# Altium project 2022飞镖系统主控板.PrjPcb
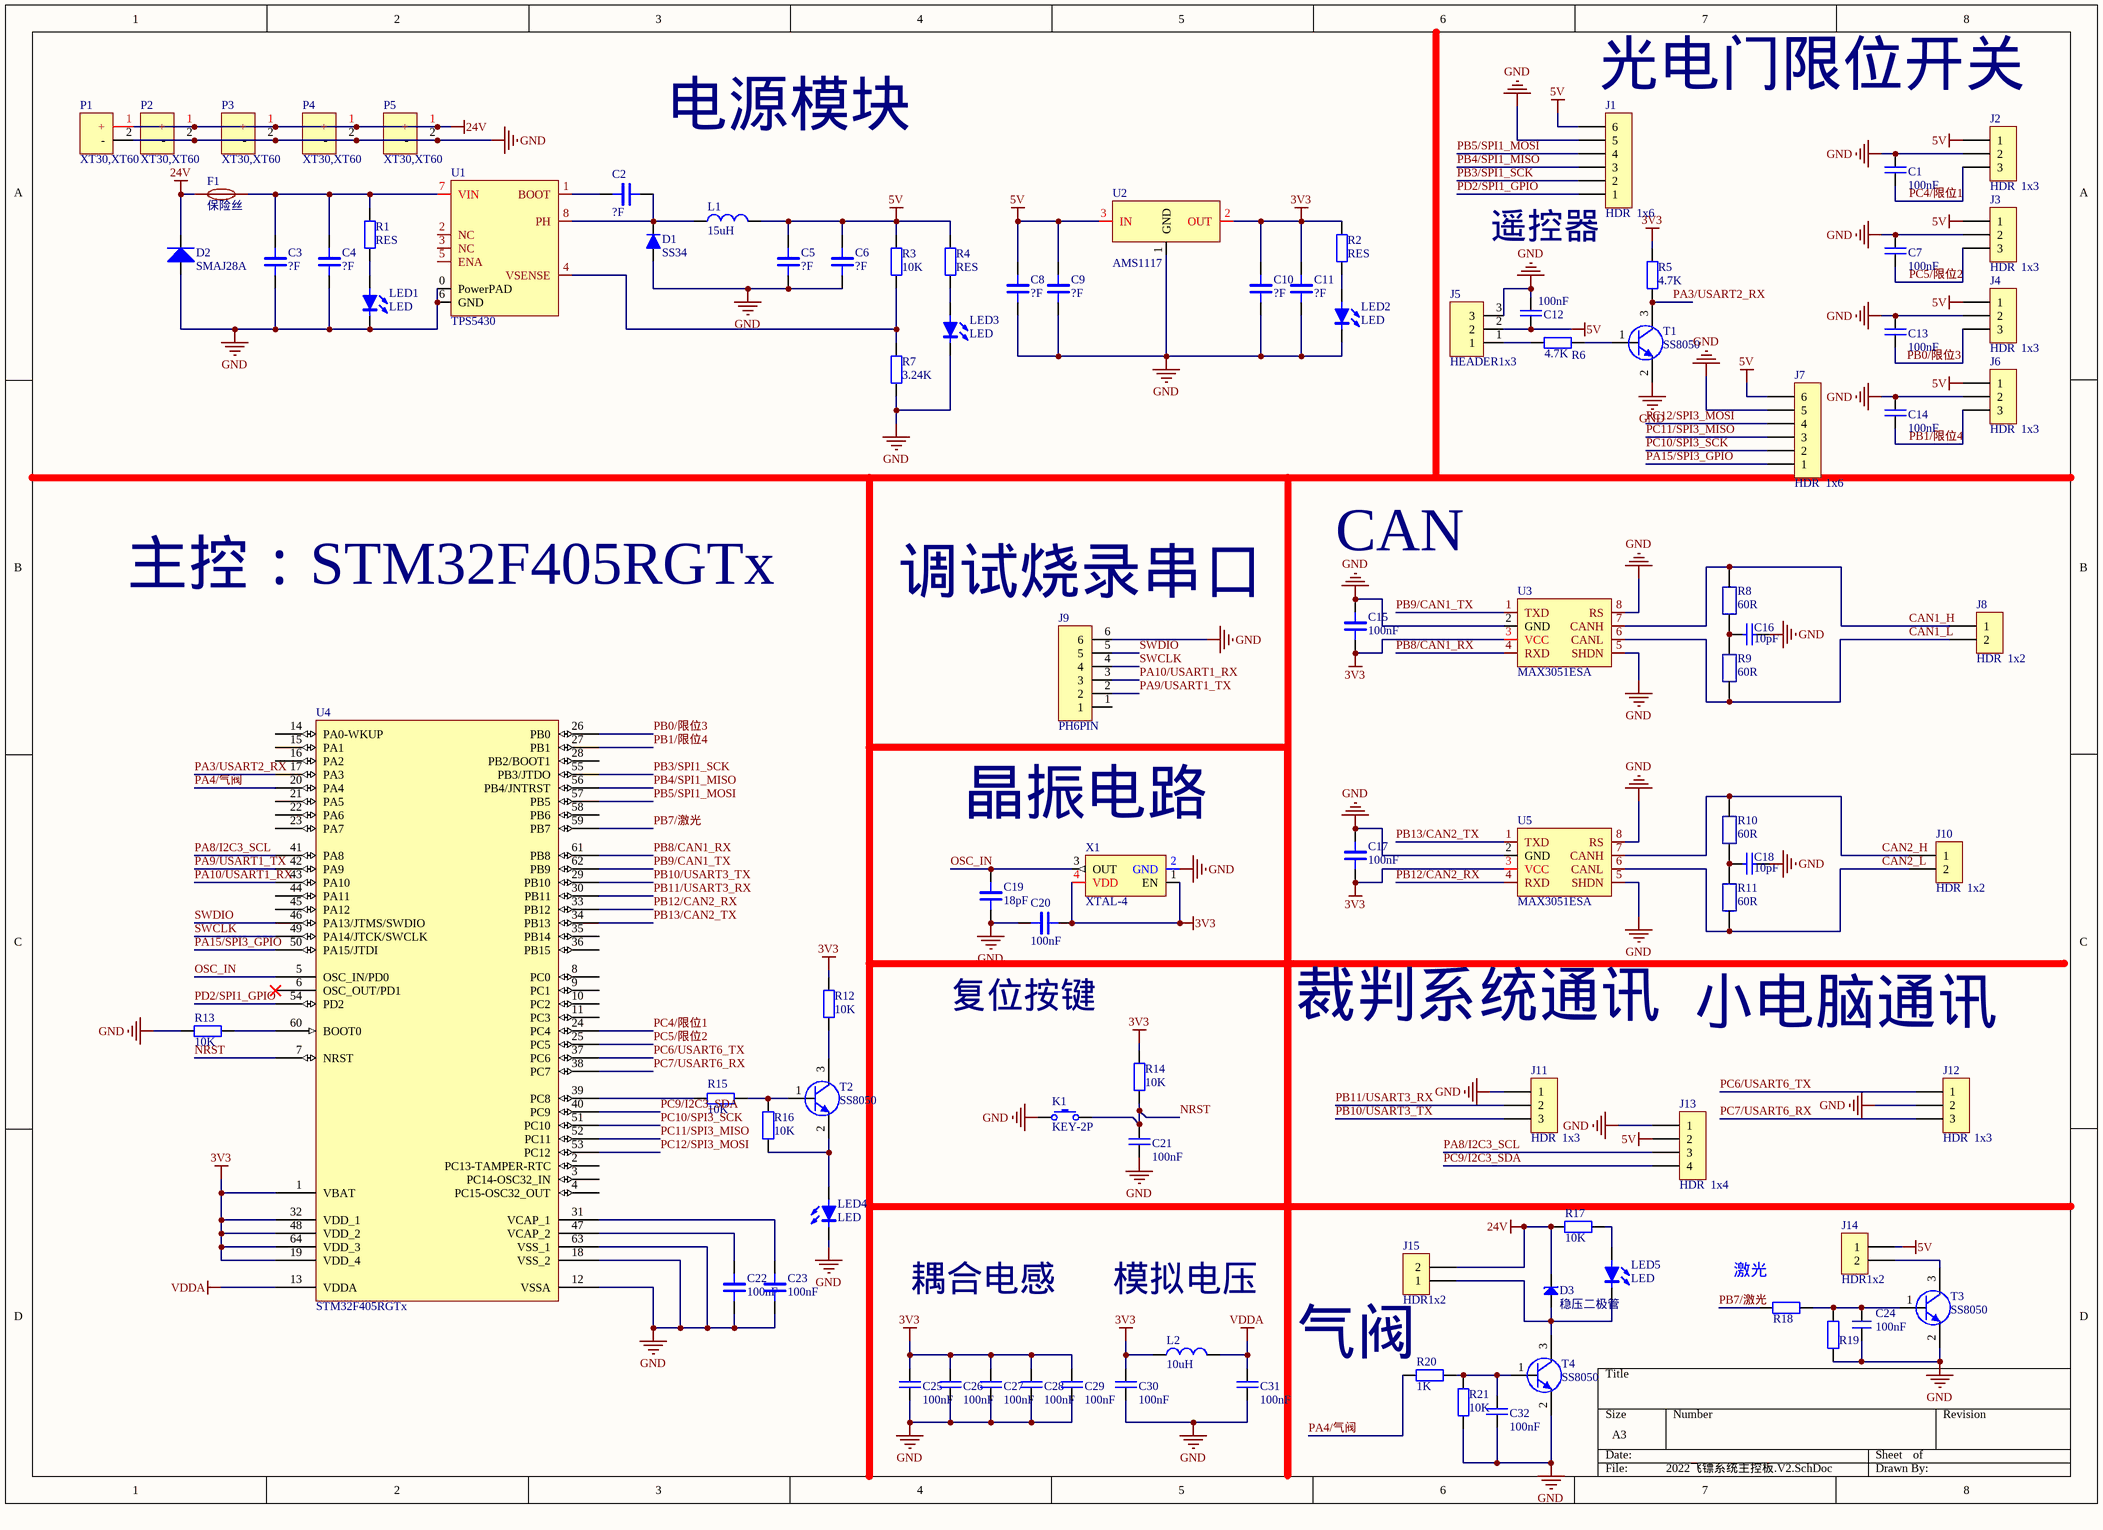
[diagram p0: 2022飞镖系统主控板.V2.SchDoc]
1 sheet, 95 parts. Net scope: global (net labels, ports and power ports of the same name join across sheets).
Board files: 2022飞镖系统主控板.PcbDoc, 2022飞镖系统主控板.V2.PcbDoc

## Sheet 2022飞镖系统主控板.V2.SchDoc
size A3; SheetNumber: 1; SheetTotal: 1

### Parts
C1  100nF  [0603_C]
C2  ?F  [0603_C]
C3  ?F  [1206_C]
C4  ?F  [1206_C]
C5  ?F  [1206_C]
C6  ?F  [1206_C]
C7  100nF  [0603_C]
C8  ?F  [1206_C]
C9  ?F  [1206_C]
C10  ?F  [1206_C]
C11  ?F  [1206_C]
C12  100nF  [0603_C]
C13  100nF  [0603_C]
C14  100nF  [0603_C]
C15  100nF  [0603_C]
C16  10pF  [0603_C]
C17  100nF  [0603_C]
C18  10pF  [0603_C]
C19  18pF  [0603_C]
C20  100nF  [0603_C]
C21  100nF  [0603_C]
C22  100nF  [0603_C]
C23  100nF  [0603_C]
C24  100nF  [0603_C]
C25  100nF  [0603_C]
C26  100nF  [0603_C]
C27  100nF  [0603_C]
C28  100nF  [0603_C]
C29  100nF  [0603_C]
C30  100nF  [0603_C]
C31  100nF  [0603_C]
C32  100nF  [0603_C]
D1  SS34  [SMA(DO-214AC)]
D2  SMAJ28A  [SMA(DO-214AC)]
D3  稳压二极管  [SOD-323]
F1  保险丝  [1812_F]
J1  HDR  1x6  [GH 6P 1.25mm 卧 贴]
J2  HDR  1x3  [PH 3P 2mm 立 插]
J3  HDR  1x3  [PH 3P 2mm 立 插]
J4  HDR  1x3  [PH 3P 2mm 立 插]
J5  HEADER1x3  [GH 3P 1.25mm 卧 贴]
J6  HDR  1x3  [PH 3P 2mm 立 插]
J7  HDR  1x6  [GH 6P 1.25mm 卧 贴]
J8  HDR  1x2  [GH 2P 1.25mm 卧 贴]
J9  PH6PIN  [PH 6P 2mm 立 插]
J10  HDR  1x2  [GH 2P 1.25mm 卧 贴]
J11  HDR  1x3  [GH 3P 1.25mm 卧 贴]
J12  HDR  1x3  [GH 3P 1.25mm 卧 贴]
J13  HDR  1x4  [排针排母 4P 2.54mm]
J14  HDR1x2  [FPC-SMD_2P-P2.00_DEALON_PH-2PWB]
J15  HDR1x2  [FPC-SMD_2P-P2.00_DEALON_PH-2PWB]
K1  KEY-2P  [SW-按键]
L1  15uH  [SMD_7.3*6.6*3MM_0630]
L2  10uH  [0603_L]
LED1  LED  [LED_0603]
LED2  LED  [LED_0603]
LED3  LED  [LED_0603]
LED4  LED  [LED_0603]
LED5  LED  [LED_0603]
P1  XT30,XT60  [XT30PW-F]
P2  XT30,XT60  [XT30PW-F]
P3  XT30,XT60  [XT30PW-F]
P4  XT30,XT60  [XT30PW-F]
P5  XT30,XT60  [XT30PW-F]
R1  RES  [0603_R]
R2  RES  [0603_R]
R3  10K  [0603_R]
R4  RES  [0603_R]
R5  4.7K  [0603_R]
R6  4.7K  [0603_R]
R7  3.24K  [0603_R]
R8  60R  [0603_R]
R9  60R  [0603_R]
R10  60R  [0603_R]
R11  60R  [0603_R]
R12  10K  [0603_R]
R13  10K  [0603_R]
R14  10K  [0603_R]
R15  10K  [0603_R]
R16  10K  [0603_R]
R17  10K  [0603_R]
R18  Res  [0603_R]  (value not drawn)
R19  Res  [0603_R]  (value not drawn)
R20  1K  [0603_R]
R21  10K  [0603_R]
T1  SS8050  [SOT-23]
T2  SS8050  [SOT-23]
T3  SS8050  [SOT-23]
T4  SS8050  [SOT-23]
U1  TPS5430  [SOP8-EP]
U2  AMS1117  [SOT-223]
U3  MAX3051ESA  [SOP8]
U4  STM32F405RGTx  [LQFP-64_10x10x05P]
U5  MAX3051ESA  [SOP8]
X1  XTAL-4  [OSC-SMD_4P]

### Nets
3V3: C10.2 C11.2 C15.2 C17.2 C20.2 C25.1 C26.1 C27.1 C28.1 C29.1 C30.1 L2.1 R2.2 R5.2 R12.1 R14.2 U2.2(OUT) U3.3(VCC) U4.1(VBAT) U4.19(VDD_4) U4.32(VDD_1) U4.48(VDD_2) U4.64(VDD_3) U5.3(VCC) X1.1(EN) X1.4(VDD)
5V: C5.2 C6.2 C8.2 C9.2 C12.1 J1.6 J2.1 J3.1 J4.1 J5.2 J6.1 J7.6 J13.2 J14.1 L1.2 R3.2 R4.2 U2.3(IN)
24V: D2.2(K) D3.2(K) F1.1 J15.2 P1.1(+) P2.1(+) P3.1(+) P4.1(+) P5.1(+) R17.1
GND: C1.1 C3.1 C4.1 C5.1 C6.1 C7.1 C8.1 C9.1 C10.1 C11.1 C12.2 C13.1 C14.1 C15.1 C16.2 C17.1 C18.2 C19.1 C20.1 C21.2 C22.1 C23.1 C24.1 C25.2 C26.2 C27.2 C28.2 C29.2 C30.2 C31.2 C32.2 D1.1 D2.1(A) J1.5 J2.2 J3.2 J4.2 J5.3 J6.2 J7.5 J9.6 J11.1 J12.2 J13.1 K1.1 LED1.2(C) LED2.2(C) LED3.2(C) LED4.2(C) P1.2(-) P2.2(-) P3.2(-) P4.2(-) P5.2(-) R7.1 R13.1 R19.1 R21.1 T1.2(E) T3.2(E) T4.2(E) U1.0(PowerPAD) U1.6(GND) U2.1(GND) U3.2(GND) U3.5(SHDN) U3.8(RS) U4.12(VSSA) U4.18(VSS_2) U4.63(VSS_1) U5.2(GND) U5.5(SHDN) U5.8(RS) X1.2(GND)
VDDA: C31.1 L2.2 U4.13(VDDA)
CAN1_H: J8.1 R8.2 U3.7(CANH)
CAN1_L: J8.2 R9.2 U3.6(CANL)
CAN2_H: J10.1 R10.2 U5.7(CANH)
CAN2_L: J10.2 R11.2 U5.6(CANL)
NRST: C21.1 K1.2 R14.1 U4.7(NRST)
OSC_IN: C19.2 U4.5(OSC_IN/PD0) X1.3(OUT)
PA3/USART2_RX: R5.1 T1.3(C) U4.17(PA3)
PA4/气阀: R20.1 U4.20(PA4)
PA8/I2C3_SCL: J13.3 U4.41(PA8)
PA9/USART1_TX: J9.2 U4.42(PA9)
PA10/USART1_RX: J9.3 U4.43(PA10)
PA15/SPI3_GPIO: J7.1 U4.50(PA15/JTDI)
PB0/限位3: C13.2 J4.3 U4.26(PB0)
PB1/限位4: C14.2 J6.3 U4.27(PB1)
PB3/SPI1_SCK: J1.2 U4.55(PB3/JTDO)
PB4/SPI1_MISO: J1.3 U4.56(PB4/JNTRST)
PB5/SPI1_MOSI: J1.4 U4.57(PB5)
PB7/激光: R18.1 U4.59(PB7)
PB8/CAN1_RX: U3.4(RXD) U4.61(PB8)
PB9/CAN1_TX: U3.1(TXD) U4.62(PB9)
PB10/USART3_TX: J11.3 U4.29(PB10)
PB11/USART3_RX: J11.2 U4.30(PB11)
PB12/CAN2_RX: U4.33(PB12) U5.4(RXD)
PB13/CAN2_TX: U4.34(PB13) U5.1(TXD)
PC4/限位1: C1.2 J2.3 U4.24(PC4)
PC5/限位2: C7.2 J3.3 U4.25(PC5)
PC6/USART6_TX: J12.1 U4.37(PC6)
PC7/USART6_RX: J12.3 U4.38(PC7)
PC9/I2C3_SDA: J13.4 U4.40(PC9)
PC10/SPI3_SCK: J7.2 U4.51(PC10)
PC11/SPI3_MISO: J7.3 U4.52(PC11)
PC12/SPI3_MOSI: J7.4 U4.53(PC12)
PD2/SPI1_GPIO: J1.1 U4.54(PD2)
SWCLK: J9.4 U4.49(PA14/JTCK/SWCLK)
SWDIO: J9.5 U4.46(PA13/JTMS/SWDIO)
NetC2_1: C2.1 U1.1(BOOT)
NetC2_2: C2.2 D1.2 L1.1 U1.8(PH)
NetC3_2: C3.2 C4.2 F1.2 R1.2 U1.7(VIN)
NetC16_1: C16.1 R8.1 R9.1
NetC18_1: C18.1 R10.1 R11.1
NetC22_2: C22.2 U4.47(VCAP_2)
NetC23_2: C23.2 U4.31(VCAP_1)
NetC24_2: C24.2 R18.2 R19.2 T3.1(B)
NetC32_1: C32.1 R20.2 R21.2 T4.1(B)
NetD3_1: D3.1(A) J15.1 LED5.2(C) T4.3(C)
NetJ5_1: J5.1 R6.2
NetJ14_2: J14.2 T3.3(C)
NetLED1_1: LED1.1(A) R1.1
NetLED2_1: LED2.1(A) R2.1
NetLED3_1: LED3.1(A) R4.1
NetLED4_1: LED4.1(A) R16.1 T2.2(E)
NetLED5_1: LED5.1(A) R17.2
NetR3_1: R3.1 R7.2 U1.4(VSENSE)
NetR6_1: R6.1 T1.1(B)
NetR12_2: R12.2 T2.3(C)
NetR13_2: R13.2 U4.60(BOOT0)
NetR15_1: R15.1 R16.2 T2.1(B)
NetR15_2: R15.2 U4.39(PC8)

Not connected (* = marked no-connect by the designer): J9 1; U1 2(NC) 3(NC) 5(ENA); U4 2(PC13-TAMPER-RTC) 3(PC14-OSC32_IN) 4(PC15-OSC32_OUT) 6(OSC_OUT/PD1)* 8(PC0) 9(PC1) 10(PC2) 11(PC3) 14(PA0-WKUP) 15(PA1) 16(PA2) 21(PA5) 22(PA6) 23(PA7) 28(PB2/BOOT1) 35(PB14) 36(PB15) 44(PA11) 45(PA12) 58(PB6)

### Notes on the sheet
- (near J1) 光电门限位开关
- 电源模块
- 遥控器
- (near C15) CAN
- 主控：STM32F405RGTx
- (near J9) 调试烧录串口
- 晶振电路
- 复位按键
- 裁判系统通讯
- 小电脑通讯
- 耦合电感
- 模拟电压
- (near R18) 激光
- 气阀

### Library data of the parts
C1 C7 C12-C14 C21 C24-C32 = Cap: Published: 8-Jun-2000; LatestRevisionDate: 17-Jul-2002; LatestRevisionNote: Re-released for DXP Platform.; PackageReference: RAD-0.3; Publisher: Altium Limited
C2-C6 C8-C11 C15 C17 C19 C20 C22 C23 = CAP: Capacitor
C16 C18 = C: ComponentLink1Description: 供应商链接; ComponentLink1URL: http://www.szlcsc.com/product/details_20375.html; Package: 0603; Supplier: LC; SuppliersPartNumber: C19666
D1 = SS34: 肖特基二极管; BOM_Manufacturer: SHOU HAN; BOM_Manufacturer Part: MSK12C02; Contributor: LCSC; BOM_Supplier: LCSC; BOM_Supplier Part: C431540; BOM_JLCPCB Part Class: Extended Part; spicePre: S; spiceSymbolName: MSK12C02
D2 = SMAJ28A: TVS
J1 J7 = HDR  1x6: Connector
J2-J4 J6 J11 J12 = HDR  1x3: Connector
J8 J10 = HDR  1x2: Connector
J9 = PH 6P
J13 = HDR  1x4: Connector
J14 J15 = HDR1x2: Connector
K1 = KEY-2P: Key
L1 L2 = Inductor: Code_IEC: 1005; Published: 8-Jun-2000; LatestRevisionDate: 17-Jul-2002; LatestRevisionNote: Re-released for DXP Platform.; PackageReference: 0402-A; Publisher: Altium Limited; Code_JEITA: 0402
P1-P5 = XT: 电源接口
R1-R4 R7 R12 R13 R15 R16 = RES: Resistor
R5 R6 R14 R17 R20 R21 = Res: Published: 8-Jun-2000; LatestRevisionDate: 17-Jul-2002; LatestRevisionNote: Re-released for DXP Platform.; PackageReference: AXIAL-0.4; Publisher: Altium Limited
R8-R11 = R
T1-T4 = SS8050: NPN; Published: 8-Jun-2000; LatestRevisionDate: 15-Jan-2003; LatestRevisionNote: PCB Footprint 'BCY-W3/D4.7' replaced; DatasheetDocument: 1997; PackageDocument: Sep-1998; PackageReference: TO-92A; Publisher: Altium Limited; Code_JEDEC: TO-92A; ComponentLink1Description: Manufacturer Link; ComponentLink1URL: http://www.fairchildsemi.com/; ComponentLink2Description: Datasheet; ComponentLink2URL: http://www.fairchildsemi.com/ds/2N%2F2N3904.pdf
U1 = TPS5430: DC-DC 降压芯片
U2 = AMS1117: LDO
U3 U5 = MAX3051ESA: CAN芯片
U4 = STM32F405RGTx: STM32单片机
X1 = XTAL-4: Oscillator
R18 R19 = Res: Published: 8-Jun-2000; LatestRevisionDate: 17-Jul-2002; LatestRevisionNote: Re-released for DXP Platform.; PackageReference: AXIAL-0.4; Publisher: Altium Limited